# Altium schematic sheet MCISO-S03-V00-PSU5VB.SchDoc
size A4; SheetNumber: 11; SheetTotal: 14
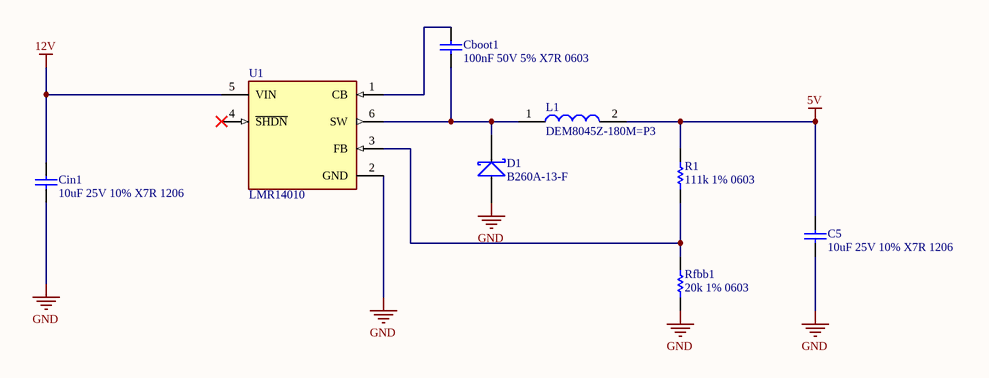
[diagram p0: MCISO-S03-V00-PSU5VB.SchDoc]

## Parts
C5  10uF 25V 10% X7R 1206  [Cap_Ceramic_1206]
Cboot1  100nF 50V 5% X7R 0603  [Cap_Ceramic_0603]
Cin1  10uF 25V 10% X7R 1206  [Cap_Ceramic_1206]
D1  B260A-13-F  [SMA]
L1  DEM8045Z-180M=P3  [1217ASH100MP3]
R1  111k 1% 0603  [Res_ThinFilm_0603]
Rfbb1  20k 1% 0603  [Res_ThinFilm_0603]
U1  LMR14010  [LMR14010]

## Nets
5V: C5.2 L1.2 R1.2
12V: Cin1.2 U1.5(VIN)
GND: C5.1 Cin1.1 D1.A Rfbb1.1 U1.2(GND)
NetCboot1_1: Cboot1.1 D1.K L1.1 U1.6(SW)
NetCboot1_2: Cboot1.2 U1.1(CB)
NetR1_1: R1.1 Rfbb1.2 U1.3(FB)

Not connected (* = marked no-connect by the designer): U1 4(~{SHDN})*

## Library data of the parts
C5 Cin1 = 10uF 25V 10% X7R 1206: Capacitor, Ceramic, SMD, 10uF, 25V, 10%, X7R, 1206
Cboot1 = 100nF 50V 5% X7R 0603: Capacitor, Ceramic, SMD, 100nF, 50V, 5%, X7R, 0603
D1 = B260A-13-F: Diode, Schottky Barrier Rectifier, 60 V, 2 A, B260A-13-F
L1 = DEM8045Z-180M=P3: Inductor; Manufacturer_Name: Murata Electronics; Datasheet Link: https://psearch.en.murata.com/inductor/product/DEM8045Z-180M%23.html; Height: 4.5mm; Manufacturer_Part_Number: DEM8045Z-180M=P3; Mouser Part Number: 81-DEM8045Z-180M=P3; Mouser Price/Stock: https://www.mouser.co.uk/ProductDetail/Murata-Electronics/DEM8045Z-180M%3dP3?qs=17u8i%2FzlE899jFmFr9F4%252Bg%3D%3D; Arrow Part Number: DEM8045Z-180M=P3; Arrow Price/Stock: https://www.arrow.com/en/products/dem8045z-180mp3/murata-manufacturing
R1 = 111k 1% 0603: Resistor, SMD, 111k, 0.1W, 1%, 0603
Rfbb1 = 19k6 1% 0603: Resistor, SMD, 19k6, 0.1W, 5%, 0603